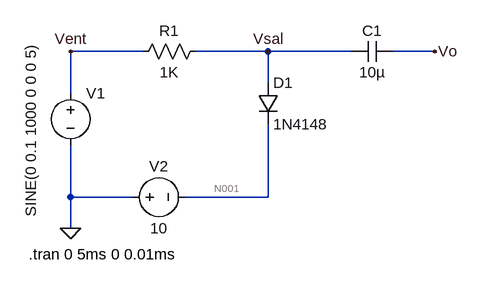
[diagram p0: schematic 2_Rd_Diodo_PN_1n4148.asc]
2_Rd_Diodo_PN_1n4148.asc, the LTspice schematic file:
Version 4
SHEET 1 880 680
WIRE 176 0 64 0
WIRE 368 0 256 0
WIRE 496 0 368 0
WIRE 624 0 560 0
WIRE 368 48 368 0
WIRE 64 64 64 0
WIRE 64 224 64 144
WIRE 160 224 64 224
WIRE 368 224 368 112
WIRE 368 224 240 224
WIRE 64 272 64 224
FLAG 64 272 0
FLAG 64 0 Vent
FLAG 368 0 Vsal
FLAG 624 0 Vo
SYMBOL voltage 64 48 R0
WINDOW 3 -61 206 VLeft 2
WINDOW 123 0 0 Left 0
WINDOW 39 0 0 Left 0
SYMATTR InstName V1
SYMATTR Value SINE(0 0.1 1000 0 0 0 5)
SYMBOL voltage 144 224 R270
WINDOW 0 32 56 VTop 2
WINDOW 3 -32 56 VBottom 2
WINDOW 123 0 0 Left 0
WINDOW 39 0 0 Left 0
SYMATTR InstName V2
SYMATTR Value 10
SYMBOL res 272 -16 R90
WINDOW 0 0 56 VBottom 2
WINDOW 3 32 56 VTop 2
SYMATTR InstName R1
SYMATTR Value 1K
SYMBOL diode 352 48 R0
SYMATTR InstName D1
SYMATTR Value 1N4148
SYMBOL cap 560 -16 R90
WINDOW 0 0 32 VBottom 2
WINDOW 3 32 32 VTop 2
SYMATTR InstName C1
SYMATTR Value 10µ
TEXT 0 312 Left 2 !.tran 0 5ms 0 0.01ms

The netlist it stands for:
* 2_Rd_Diodo_PN_1n4148.asc
V1 Vent 0 SINE(0 0.1 1000 0 0 0 5)
V2 0 N001 10
R1 Vsal Vent 1K
D1 Vsal N001 1N4148
C1 Vo Vsal 10µ
.model D D
.lib standard.dio
.tran 0 5ms 0 0.01ms
.backanno
.end

* Results of the author's LTspice run, read from the files saved beside the schematic
* Operating Point, zero values left out:
*   V(n001) = -10 V
*   V(vsal) = -9.309 V
*   V(vo) = -93.09 µV
*   I(D1) = 9.309 mA
*   I(R1) = -9.309 mA
*   I(V1) = -9.309 mA
*   I(V2) = -9.309 mA
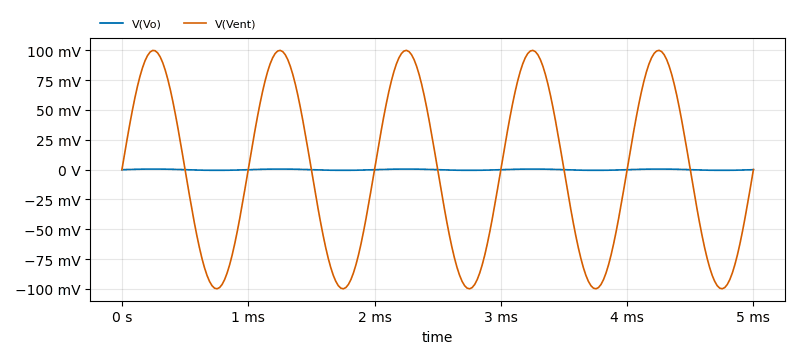
[diagram p1: Transient Analysis of 2_Rd_Diodo_PN_1n4148.asc, plotted from the saved traces]
* Transient Analysis, 1 run:
*   V(Vo): min -636.6 µV, max 443.4 µV, average -95.33 µV, rms 393.6 µV, last -94.11 µV
*   V(Vent): min -99.98 mV, max 99.98 mV, average -54.68 nV, rms 70.71 mV, last 0 V